# EAGLE schematic x0_logic_v0001 (EAGLE 8.0.0)

## Sheet 1 of 7: 3V3 PSU This page is for the 3.3V linear voltage regulator that supplies the power to the MCU and most of the peripherals. The regulator is a TI TPS7A4700 Ultra-Low Noise lienar regulator. The specs are as follows: Adjustable Voltge Input Range: +3V to +36V Output Current: 1A Dropout Voltage: 307mV @ 1A The surrounding components have been selected to allow up to 35V input voltage. However, this will require the addition of a heatsink on the regulator. The thermal pad has vias that go to the ground plane, but the bottom layer has tons of traces that split the ground plane up significantly. The internal plane does not dissapate heat as efficiently as the external. The suggested input voltage should be no higher than 8.4V, the peak voltage of a 2S LiPo.
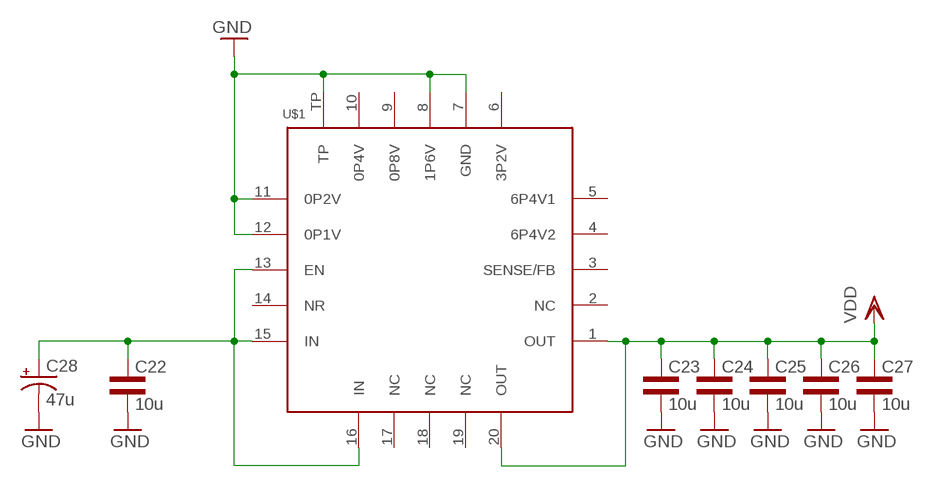
[diagram p0: schematic, sheet 1]

### Parts
C22  10u  CAP1206L3  [1206L3]
C23  10u  CAP1206L3  [1206L3]
C24  10u  CAP1206L3  [1206L3]
C25  10u  CAP1206L3  [1206L3]
C26  10u  CAP1206L3  [1206L3]
C27  10u  CAP1206L3  [1206L3]
C28  47u  CPOL-USCT7343  [CT7343]
U$1  POWER-SUPPLY_POS_V1_TI_LDO_TPS7A4700  [POWER-SUPPLY_POS_V1_TI_LDO_VQFN-20]

### Nets
BATT+: C22.1 C28.+ U$1.13(EN) U$1.15(IN) U$1.16(IN) ; also sheet 2
GND: C22.2 C23.2 C24.2 C25.2 C26.2 C27.2 C28.- U$1.7(GND) U$1.8(1P6V) U$1.11(0P2V) U$1.12(0P1V) U$1.TP ; also sheet 2,3,4,5,7
VDD: C23.1 C24.1 C25.1 C26.1 C27.1 U$1.1(OUT) U$1.20(OUT) ; also sheet 3,4,5,7
Unconnected: U$1.2(NC) U$1.3(SENSE/FB) U$1.4(6P4V2) U$1.5(6P4V1) U$1.6(3P2V) U$1.9(0P8V) U$1.10(0P4V) U$1.14(NR) U$1.17(NC) U$1.18(NC) U$1.19(NC)

## Sheet 2 of 7: 5V PSU This page is for the 5V linear voltage regulator that supplies the power to the peripherals that require a 5V rail. The regulator is a TI TPS7A4700 Ultra-Low Noise lienar regulator. The specs are as follows: Adjustable Voltge Input Range: +3V to +36V Output Current: 1A Dropout Voltage: 307mV @ 1A The surrounding components have been selected to allow up to 35V input voltage. However, this will require the addition of a heatsink on the regulator. The thermal pad has vias that go to the ground plane, but the bottom layer has tons of traces that split the ground plane up significantly. The internal plane does not dissapate heat as efficiently as the external. The suggested input voltage should be no higher than 8.4V, the peak voltage of a 2S LiPo.
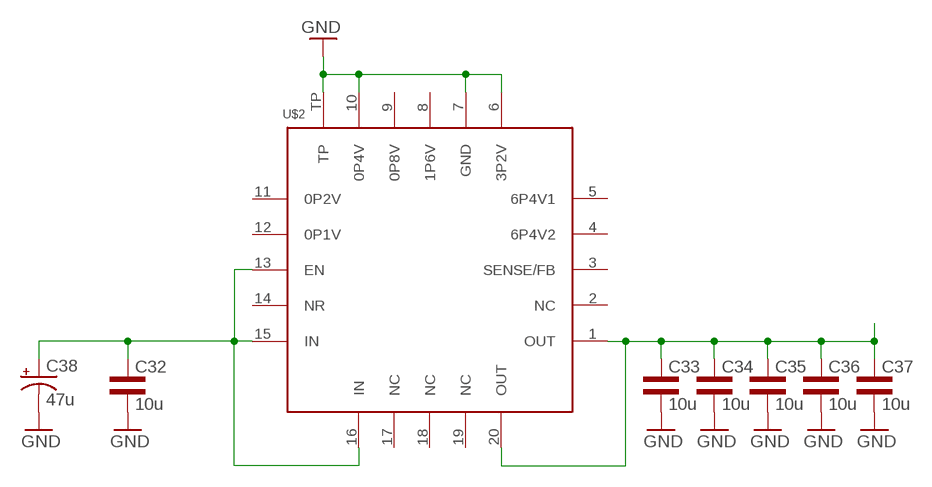
[diagram p1: schematic, sheet 2]

### Parts
C32  10u  CAP1206L3  [1206L3]
C33  10u  CAP1206L3  [1206L3]
C34  10u  CAP1206L3  [1206L3]
C35  10u  CAP1206L3  [1206L3]
C36  10u  CAP1206L3  [1206L3]
C37  10u  CAP1206L3  [1206L3]
C38  47u  CPOL-USCT7343  [CT7343]
U$2  POWER-SUPPLY_POS_V1_TI_LDO_TPS7A4700  [POWER-SUPPLY_POS_V1_TI_LDO_VQFN-20]

### Nets
5V: C33.1 C34.1 C35.1 C36.1 C37.1 U$2.1(OUT) U$2.20(OUT) ; also sheet 5,7
BATT+: C32.1 C38.+ U$2.13(EN) U$2.15(IN) U$2.16(IN) ; also sheet 1
GND: C32.2 C33.2 C34.2 C35.2 C36.2 C37.2 C38.- U$2.6(3P2V) U$2.7(GND) U$2.10(0P4V) U$2.TP ; also sheet 1,3,4,5,7
Unconnected: U$2.2(NC) U$2.3(SENSE/FB) U$2.4(6P4V2) U$2.5(6P4V1) U$2.8(1P6V) U$2.9(0P8V) U$2.11(0P2V) U$2.12(0P1V) U$2.14(NR) U$2.17(NC) U$2.18(NC) U$2.19(NC)

## Sheet 3 of 7: MCU
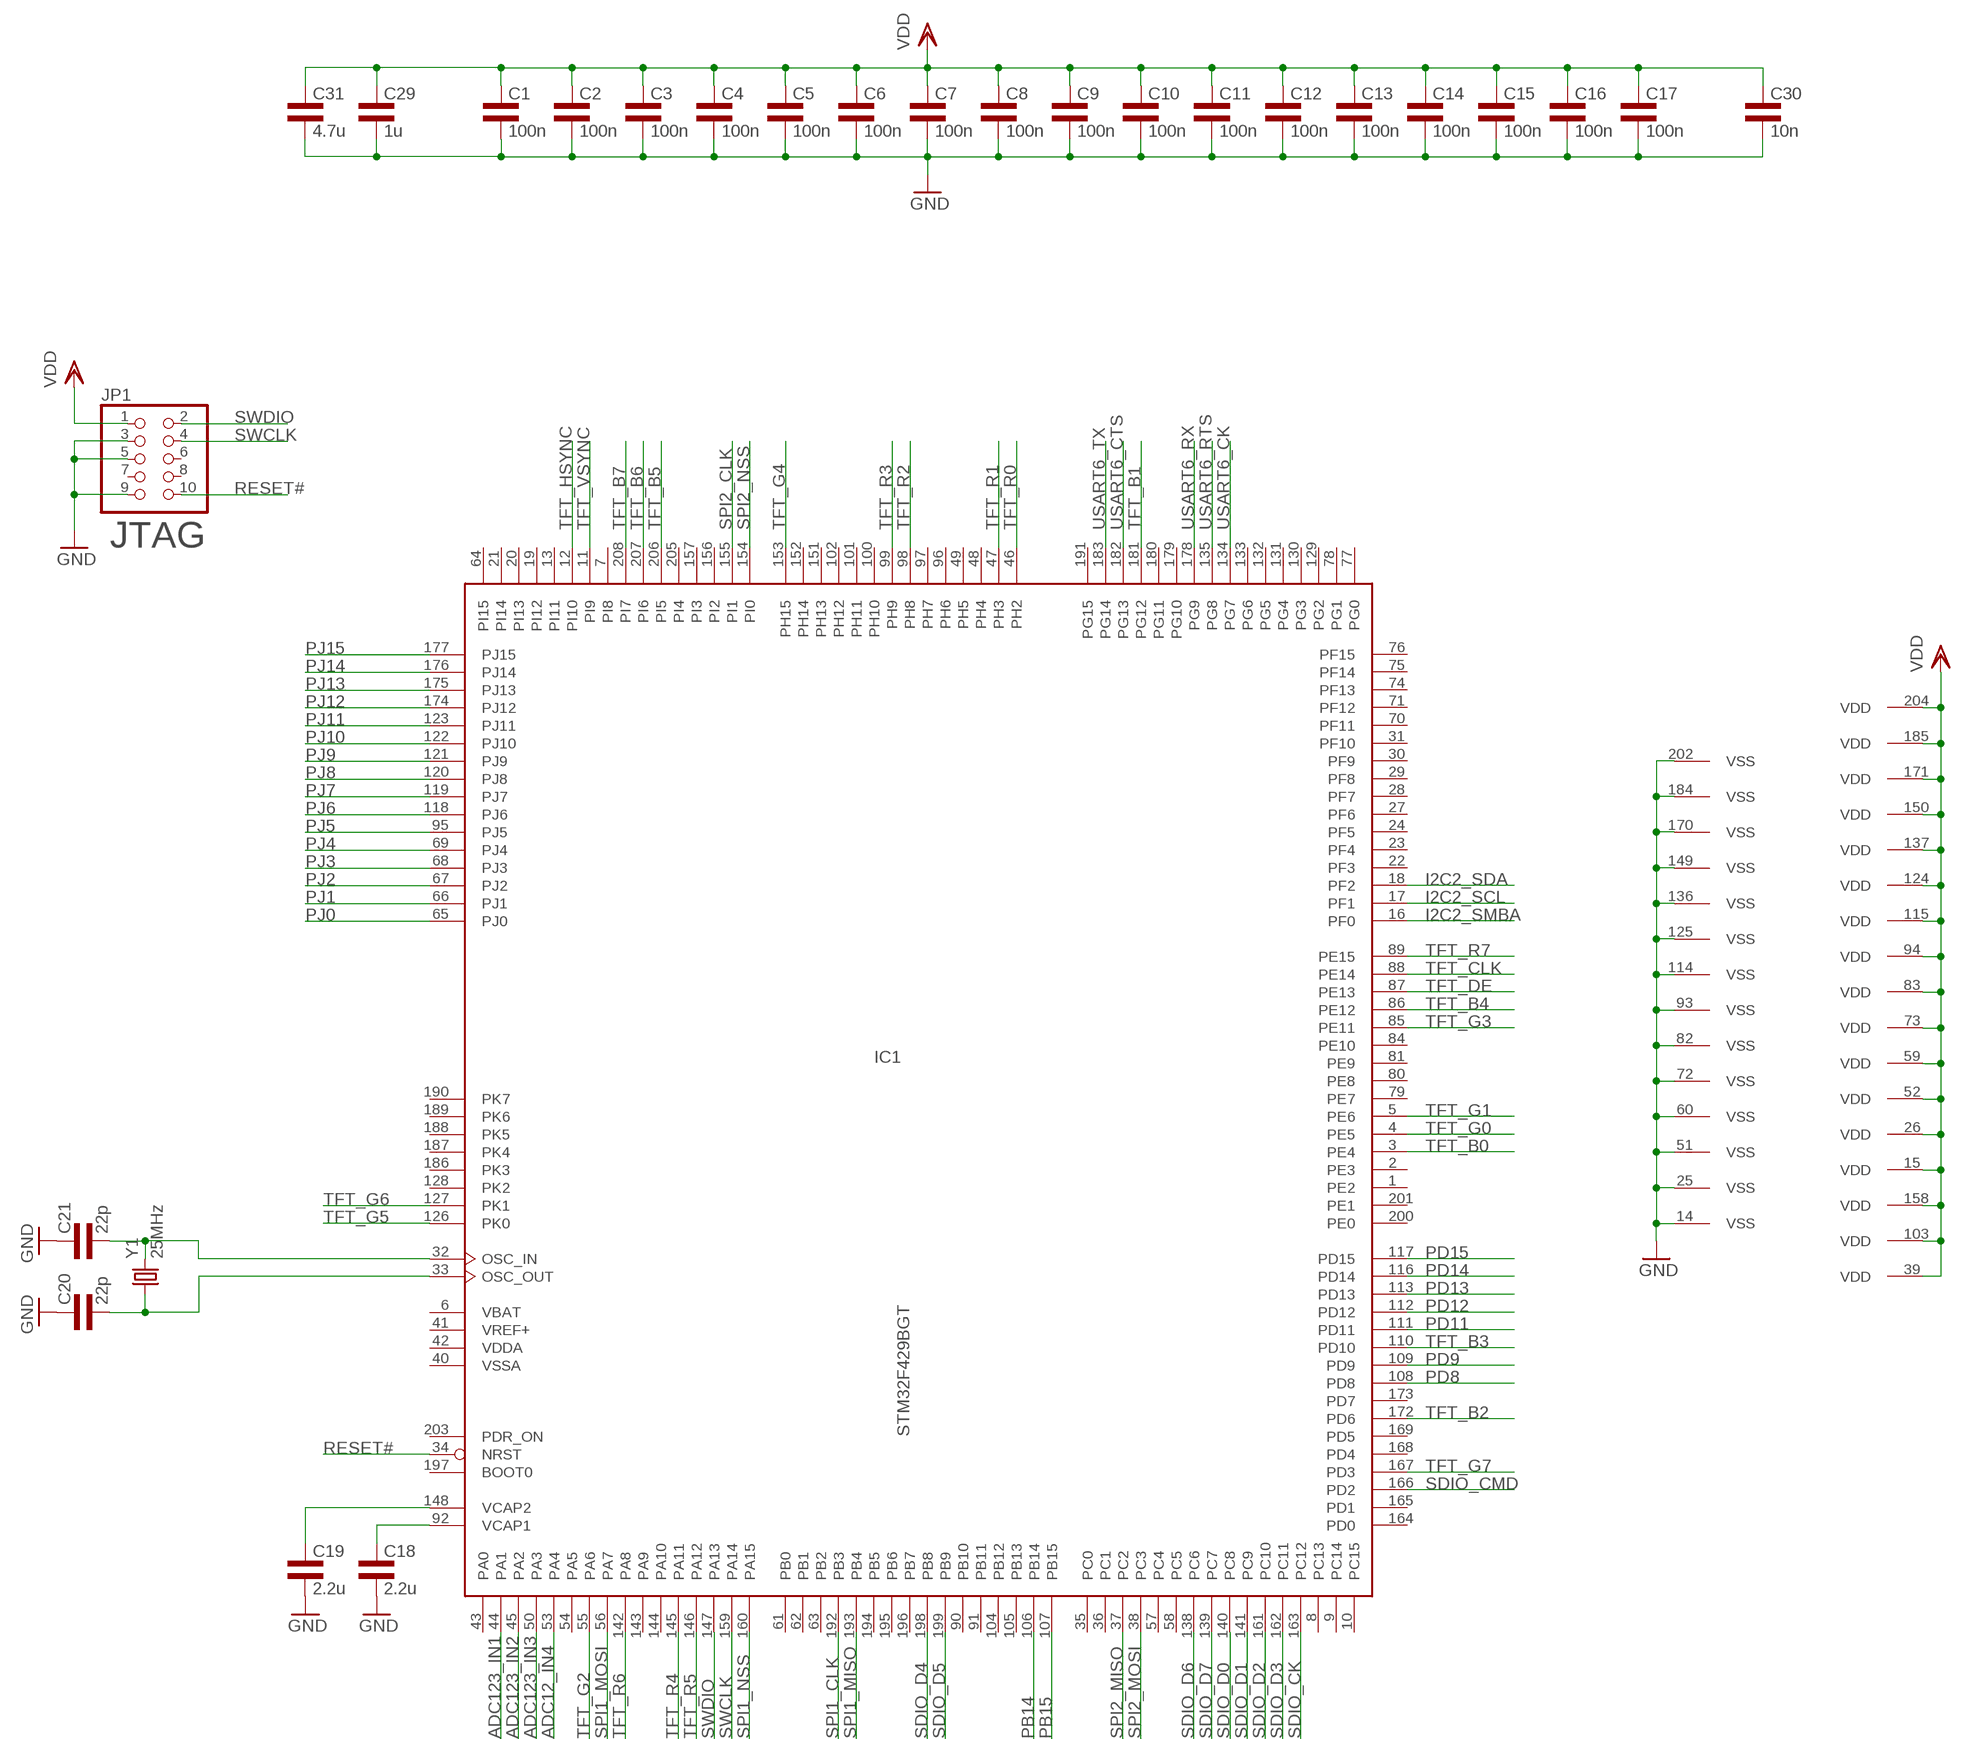
[diagram p2: schematic, sheet 3]

### Parts
C1  100n  CAP0402L3  [0402L3]
C2  100n  CAP0402L3  [0402L3]
C3  100n  CAP0402L3  [0402L3]
C4  100n  CAP0402L3  [0402L3]
C5  100n  CAP0402L3  [0402L3]
C6  100n  CAP0402L3  [0402L3]
C7  100n  CAP0402L3  [0402L3]
C8  100n  CAP0402L3  [0402L3]
C9  100n  CAP0402L3  [0402L3]
C10  100n  CAP0402L3  [0402L3]
C11  100n  CAP0402L3  [0402L3]
C12  100n  CAP0402L3  [0402L3]
C13  100n  CAP0402L3  [0402L3]
C14  100n  CAP0402L3  [0402L3]
C15  100n  CAP0402L3  [0402L3]
C16  100n  CAP0402L3  [0402L3]
C17  100n  CAP0402L3  [0402L3]
C18  2.2u  CAP0603L3  [0603L3]
C19  2.2u  CAP0603L3  [0603L3]
C20  22p  CAP0402L3  [0402L3]
C21  22p  CAP0402L3  [0402L3]
C29  1u  CAP0805L3  [0805L3]
C30  10n  CAP0603L3  [0603L3]
C31  4.7u  CAP0805L3  [0805L3]
IC1  STM32F429BGT  [LQFP208]
JP1  PINHD-2X5  [2X05]
Y1  25MHz  CRYSTALHC49US  [HC49US]

### Nets
ADC12_IN4: IC1.53(PA4) ; also sheet 6
ADC123_IN1: IC1.44(PA1) ; also sheet 6
ADC123_IN2: IC1.45(PA2) ; also sheet 6
ADC123_IN3: IC1.50(PA3) ; also sheet 6
GND: C1.P$2 C2.P$2 C3.P$2 C4.P$2 C5.P$2 C6.P$2 C7.P$2 C8.P$2 C9.P$2 C10.P$2 C11.P$2 C12.P$2 C13.P$2 C14.P$2 C15.P$2 C16.P$2 C17.P$2 C18.P$2 C19.P$2 C20.P$1 C21.P$1 C29.2 C30.P$2 C31.2 IC1.14(VSS) IC1.25(VSS) IC1.51(VSS) IC1.60(VSS) IC1.72(VSS) IC1.82(VSS) IC1.93(VSS) IC1.114(VSS) IC1.125(VSS) IC1.136(VSS) IC1.149(VSS) IC1.170(VSS) IC1.184(VSS) IC1.202(VSS) JP1.3 JP1.5 JP1.9 ; also sheet 1,2,4,5,7
I2C2_SCL: IC1.17(PF1) ; also sheet 5
I2C2_SDA: IC1.18(PF2) ; also sheet 5
I2C2_SMBA: IC1.16(PF0) ; also sheet 5
N$1: C18.P$1 IC1.92(VCAP1)
N$2: C19.P$1 IC1.148(VCAP2)
N$3: C20.P$2 IC1.33(OSC_OUT) Y1.1
N$4: C21.P$2 IC1.32(OSC_IN) Y1.2
PB14: IC1.106(PB14)
PB15: IC1.107(PB15) ; also sheet 6
PD8: IC1.108(PD8)
PD9: IC1.109(PD9)
PD11: IC1.111(PD11)
PD12: IC1.112(PD12)
PD13: IC1.113(PD13)
PD14: IC1.116(PD14)
PD15: IC1.117(PD15)
PJ0 [portj]: IC1.65(PJ0) ; also sheet 6
PJ1 [portj]: IC1.66(PJ1) ; also sheet 6
PJ2 [portj]: IC1.67(PJ2) ; also sheet 6
PJ3 [portj]: IC1.68(PJ3) ; also sheet 6
PJ4 [portj]: IC1.69(PJ4) ; also sheet 6
PJ5 [portj]: IC1.95(PJ5) ; also sheet 6
PJ6 [portj]: IC1.118(PJ6) ; also sheet 6
PJ7 [portj]: IC1.119(PJ7) ; also sheet 6
PJ8 [portj]: IC1.120(PJ8) ; also sheet 6
PJ9 [portj]: IC1.121(PJ9) ; also sheet 6
PJ10 [portj]: IC1.122(PJ10) ; also sheet 6
PJ11 [portj]: IC1.123(PJ11) ; also sheet 6
PJ12 [portj]: IC1.174(PJ12) ; also sheet 6
PJ13 [portj]: IC1.175(PJ13) ; also sheet 6
PJ14 [portj]: IC1.176(PJ14) ; also sheet 6
PJ15 [portj]: IC1.177(PJ15) ; also sheet 6
RESET#: IC1.34(NRST) JP1.10
SDIO_CK: IC1.163(PC12) ; also sheet 5
SDIO_CMD: IC1.166(PD2) ; also sheet 5
SDIO_D0: IC1.140(PC8) ; also sheet 5
SDIO_D1: IC1.141(PC9) ; also sheet 5
SDIO_D2: IC1.161(PC10) ; also sheet 5
SDIO_D3: IC1.162(PC11) ; also sheet 5
SDIO_D4: IC1.198(PB8)
SDIO_D5: IC1.199(PB9)
SDIO_D6: IC1.138(PC6)
SDIO_D7: IC1.139(PC7)
SPI1_CLK: IC1.192(PB3) ; also sheet 5
SPI1_MISO: IC1.193(PB4) ; also sheet 5
SPI1_MOSI: IC1.56(PA7) ; also sheet 5
SPI1_NSS: IC1.160(PA15) ; also sheet 5
SPI2_CLK: IC1.155(PI1) ; also sheet 5
SPI2_MISO: IC1.37(PC2) ; also sheet 5
SPI2_MOSI: IC1.38(PC3) ; also sheet 5
SPI2_NSS: IC1.154(PI0) ; also sheet 5
SWCLK: IC1.159(PA14) JP1.4
SWDIO: IC1.147(PA13) JP1.2
TFT_B0: IC1.3(PE4) ; also sheet 4
TFT_B1: IC1.181(PG12) ; also sheet 4
TFT_B2: IC1.172(PD6) ; also sheet 4
TFT_B3: IC1.110(PD10) ; also sheet 4
TFT_B4: IC1.86(PE12) ; also sheet 4
TFT_B5: IC1.206(PI5) ; also sheet 4
TFT_B6: IC1.207(PI6) ; also sheet 4
TFT_B7: IC1.208(PI7) ; also sheet 4
TFT_CLK: IC1.88(PE14) ; also sheet 4
TFT_DE: IC1.87(PE13) ; also sheet 4
TFT_G0: IC1.4(PE5) ; also sheet 4
TFT_G1: IC1.5(PE6) ; also sheet 4
TFT_G2: IC1.55(PA6) ; also sheet 4
TFT_G3: IC1.85(PE11) ; also sheet 4
TFT_G4: IC1.153(PH15) ; also sheet 4
TFT_G5: IC1.126(PK0) ; also sheet 4
TFT_G6: IC1.127(PK1) ; also sheet 4
TFT_G7: IC1.167(PD3) ; also sheet 4
TFT_HSYNC: IC1.12(PI10) ; also sheet 4
TFT_R0: IC1.46(PH2) ; also sheet 4
TFT_R1: IC1.47(PH3) ; also sheet 4
TFT_R2: IC1.98(PH8) ; also sheet 4
TFT_R3: IC1.99(PH9) ; also sheet 4
TFT_R4: IC1.145(PA11) ; also sheet 4
TFT_R5: IC1.146(PA12) ; also sheet 4
TFT_R6: IC1.142(PA8) ; also sheet 4
TFT_R7: IC1.89(PE15) ; also sheet 4
TFT_VSYNC: IC1.11(PI9) ; also sheet 4
USART6_CK: IC1.134(PG7)
USART6_CTS: IC1.182(PG13)
USART6_RTS: IC1.135(PG8)
USART6_RX: IC1.178(PG9)
USART6_TX: IC1.183(PG14)
VDD: C1.P$1 C2.P$1 C3.P$1 C4.P$1 C5.P$1 C6.P$1 C7.P$1 C8.P$1 C9.P$1 C10.P$1 C11.P$1 C12.P$1 C13.P$1 C14.P$1 C15.P$1 C16.P$1 C17.P$1 C29.1 C30.P$1 C31.1 IC1.15(VDD) IC1.26(VDD) IC1.39(VDD) IC1.52(VDD) IC1.59(VDD) IC1.73(VDD) IC1.83(VDD) IC1.94(VDD) IC1.103(VDD) IC1.115(VDD) IC1.124(VDD) IC1.137(VDD) IC1.150(VDD) IC1.158(VDD) IC1.171(VDD) IC1.185(VDD) IC1.204(VDD) JP1.1 ; also sheet 1,4,5,7
Unconnected: IC1.1(PE2) IC1.2(PE3) IC1.7(PI8) IC1.8(PC13) IC1.9(PC14) IC1.10(PC15) IC1.13(PI11) IC1.19(PI12) IC1.20(PI13) IC1.21(PI14) IC1.22(PF3) IC1.23(PF4) IC1.24(PF5) IC1.27(PF6) IC1.28(PF7) IC1.29(PF8) IC1.30(PF9) IC1.31(PF10) IC1.35(PC0) IC1.36(PC1) IC1.43(PA0) IC1.48(PH4) IC1.49(PH5) IC1.54(PA5) IC1.57(PC4) IC1.58(PC5) IC1.61(PB0) IC1.62(PB1) IC1.63(PB2) IC1.64(PI15) IC1.70(PF11) IC1.71(PF12) IC1.74(PF13) IC1.75(PF14) IC1.76(PF15) IC1.77(PG0) IC1.78(PG1) IC1.79(PE7) IC1.80(PE8) IC1.81(PE9) IC1.84(PE10) IC1.90(PB10) IC1.91(PB11) IC1.96(PH6) IC1.97(PH7) IC1.100(PH10) IC1.101(PH11) IC1.102(PH12) IC1.104(PB12) IC1.105(PB13) IC1.128(PK2) IC1.129(PG2) IC1.130(PG3) IC1.131(PG4) IC1.132(PG5) IC1.133(PG6) IC1.143(PA9) IC1.144(PA10) IC1.151(PH13) IC1.152(PH14) IC1.156(PI2) IC1.157(PI3) IC1.164(PD0) IC1.165(PD1) IC1.168(PD4) IC1.169(PD5) IC1.173(PD7) IC1.179(PG10) IC1.180(PG11) IC1.186(PK3) IC1.187(PK4) IC1.188(PK5) IC1.189(PK6) IC1.190(PK7) IC1.191(PG15) IC1.194(PB5) IC1.195(PB6) IC1.196(PB7) IC1.197(BOOT0) IC1.200(PE0) IC1.201(PE1) IC1.203(PDR_ON) IC1.205(PI4) JP1.6 JP1.7 JP1.8

### Notes on the sheet
- JTAG

## Sheet 4 of 7: TFT Conn
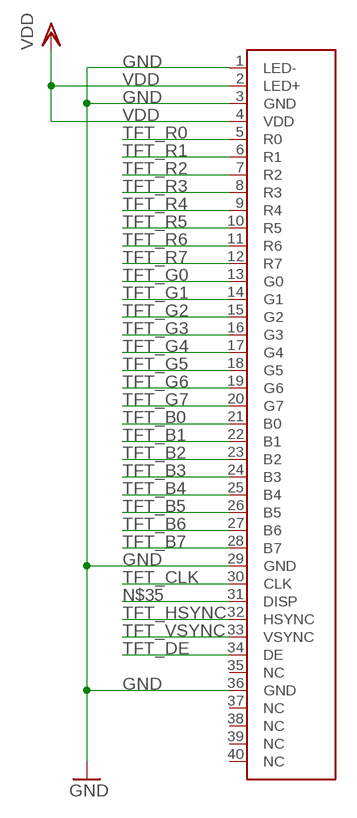
[diagram p3: schematic, sheet 4]

### Parts
CON1  NH-4.3  [FPC-40]

### Nets
GND: CON1.1(LED-) CON1.3(GND) CON1.29(GND) CON1.36(GND) ; also sheet 1,2,3,5,7
N$35: CON1.31(DISP)
TFT_B0: CON1.21(B0) ; also sheet 3
TFT_B1: CON1.22(B1) ; also sheet 3
TFT_B2: CON1.23(B2) ; also sheet 3
TFT_B3: CON1.24(B3) ; also sheet 3
TFT_B4: CON1.25(B4) ; also sheet 3
TFT_B5: CON1.26(B5) ; also sheet 3
TFT_B6: CON1.27(B6) ; also sheet 3
TFT_B7: CON1.28(B7) ; also sheet 3
TFT_CLK: CON1.30(CLK) ; also sheet 3
TFT_DE: CON1.34(DE) ; also sheet 3
TFT_G0: CON1.13(G0) ; also sheet 3
TFT_G1: CON1.14(G1) ; also sheet 3
TFT_G2: CON1.15(G2) ; also sheet 3
TFT_G3: CON1.16(G3) ; also sheet 3
TFT_G4: CON1.17(G4) ; also sheet 3
TFT_G5: CON1.18(G5) ; also sheet 3
TFT_G6: CON1.19(G6) ; also sheet 3
TFT_G7: CON1.20(G7) ; also sheet 3
TFT_HSYNC: CON1.32(HSYNC) ; also sheet 3
TFT_R0: CON1.5(R0) ; also sheet 3
TFT_R1: CON1.6(R1) ; also sheet 3
TFT_R2: CON1.7(R2) ; also sheet 3
TFT_R3: CON1.8(R3) ; also sheet 3
TFT_R4: CON1.9(R4) ; also sheet 3
TFT_R5: CON1.10(R5) ; also sheet 3
TFT_R6: CON1.11(R6) ; also sheet 3
TFT_R7: CON1.12(R7) ; also sheet 3
TFT_VSYNC: CON1.33(VSYNC) ; also sheet 3
VDD: CON1.2(LED+) CON1.4(VDD) ; also sheet 1,3,5,7
Unconnected: CON1.35(NC) CON1.37(NC) CON1.38(NC) CON1.39(NC) CON1.40(NC)

## Sheet 5 of 7: FFC Header Socket
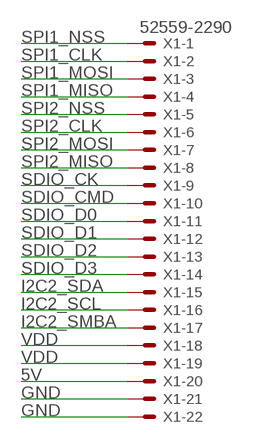
[diagram p4: schematic, sheet 5]

### Parts
X1  52559-2290  [52559-2290]

### Nets
5V: X1.20 ; also sheet 2,7
GND: X1.21 X1.22 ; also sheet 1,2,3,4,7
I2C2_SCL: X1.16 ; also sheet 3
I2C2_SDA: X1.15 ; also sheet 3
I2C2_SMBA: X1.17 ; also sheet 3
SDIO_CK: X1.9 ; also sheet 3
SDIO_CMD: X1.10 ; also sheet 3
SDIO_D0: X1.11 ; also sheet 3
SDIO_D1: X1.12 ; also sheet 3
SDIO_D2: X1.13 ; also sheet 3
SDIO_D3: X1.14 ; also sheet 3
SPI1_CLK: X1.2 ; also sheet 3
SPI1_MISO: X1.4 ; also sheet 3
SPI1_MOSI: X1.3 ; also sheet 3
SPI1_NSS: X1.1 ; also sheet 3
SPI2_CLK: X1.6 ; also sheet 3
SPI2_MISO: X1.8 ; also sheet 3
SPI2_MOSI: X1.7 ; also sheet 3
SPI2_NSS: X1.5 ; also sheet 3
VDD: X1.18 X1.19 ; also sheet 1,3,4,7

## Sheet 6 of 7: Extra Header
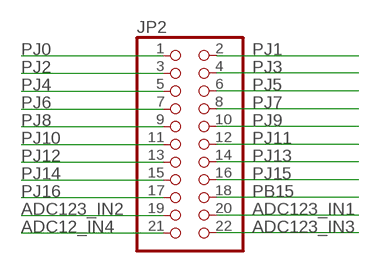
[diagram p5: schematic, sheet 6]

### Parts
JP2  PINHD-2X11  [2X11]

### Nets
ADC12_IN4: JP2.21 ; also sheet 3
ADC123_IN1: JP2.20 ; also sheet 3
ADC123_IN2: JP2.19 ; also sheet 3
ADC123_IN3: JP2.22 ; also sheet 3
PB15: JP2.18 ; also sheet 3
PJ0 [portj]: JP2.1 ; also sheet 3
PJ1 [portj]: JP2.2 ; also sheet 3
PJ2 [portj]: JP2.3 ; also sheet 3
PJ3 [portj]: JP2.4 ; also sheet 3
PJ4 [portj]: JP2.5 ; also sheet 3
PJ5 [portj]: JP2.6 ; also sheet 3
PJ6 [portj]: JP2.7 ; also sheet 3
PJ7 [portj]: JP2.8 ; also sheet 3
PJ8 [portj]: JP2.9 ; also sheet 3
PJ9 [portj]: JP2.10 ; also sheet 3
PJ10 [portj]: JP2.11 ; also sheet 3
PJ11 [portj]: JP2.12 ; also sheet 3
PJ12 [portj]: JP2.13 ; also sheet 3
PJ13 [portj]: JP2.14 ; also sheet 3
PJ14 [portj]: JP2.15 ; also sheet 3
PJ15 [portj]: JP2.16 ; also sheet 3
PJ16: JP2.17

## Sheet 7 of 7: Power Header
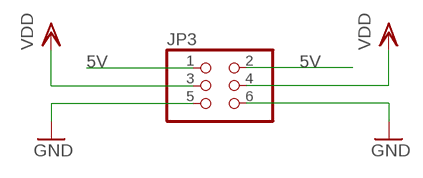
[diagram p6: schematic, sheet 7]

### Parts
JP3  PINHD-2X3  [2X03]

### Nets
5V: JP3.1 JP3.2 ; also sheet 2,5
GND: JP3.5 JP3.6 ; also sheet 1,2,3,4,5
VDD: JP3.3 JP3.4 ; also sheet 1,3,4,5

## Power pins joined to a net without a drawn wire
VBAT: IC1.6(VBAT)
VDDA: IC1.42(VDDA)
VREF+: IC1.41(VREF+)
VSSA: IC1.40(VSSA)

## Library data of the parts
C1-C27 C29-C37 = common:CAP
C28 C38 = rcl:CPOL-US: POLARIZED CAPACITOR, American symbol
CON1 = common:NH-4.3
IC1 = micro-stm_v3:STM32F429B*T: ARM 32-bit Cortex™-M3 CPU 180 MHz maximum frequency 1024 to 2048 Kbytes of Flash memory 256 kbytes of SRAM 168 GPIOs 1.8 to 3.6 V application supply
JP1 = pinhead:PINHD-2X5: PIN HEADER
JP2 = pinhead:PINHD-2X11: PIN HEADER
JP3 = pinhead:PINHD-2X3: PIN HEADER
U$1 U$2 = my_dac_amp:POWER-SUPPLY_POS_V1_TI_LDO_TPS7A4700
X1 = con-molex:52559-2290: FFC/FPC-to-Board 0.50mm (.020") SMT, Vertical, ZIF Receptacle Source: http://www.molex.com/product/ffc/52559.html; MPN: 52559-2290; OC_FARNELL: unknown; OC_NEWARK: 92M6193
Y1 = SparkFun-FreqCtrl:CRYSTAL: Various standard crystals. Proven footprints. Spark Fun Electronics SKU : COM-00534

## Net classes
1 portj: width 0.203 mm, drill 0.254 mm, clearance 0.127 mm to class 0, clearance 0.127 mm